# EAGLE design EEGHat (EAGLE 9.6.2)
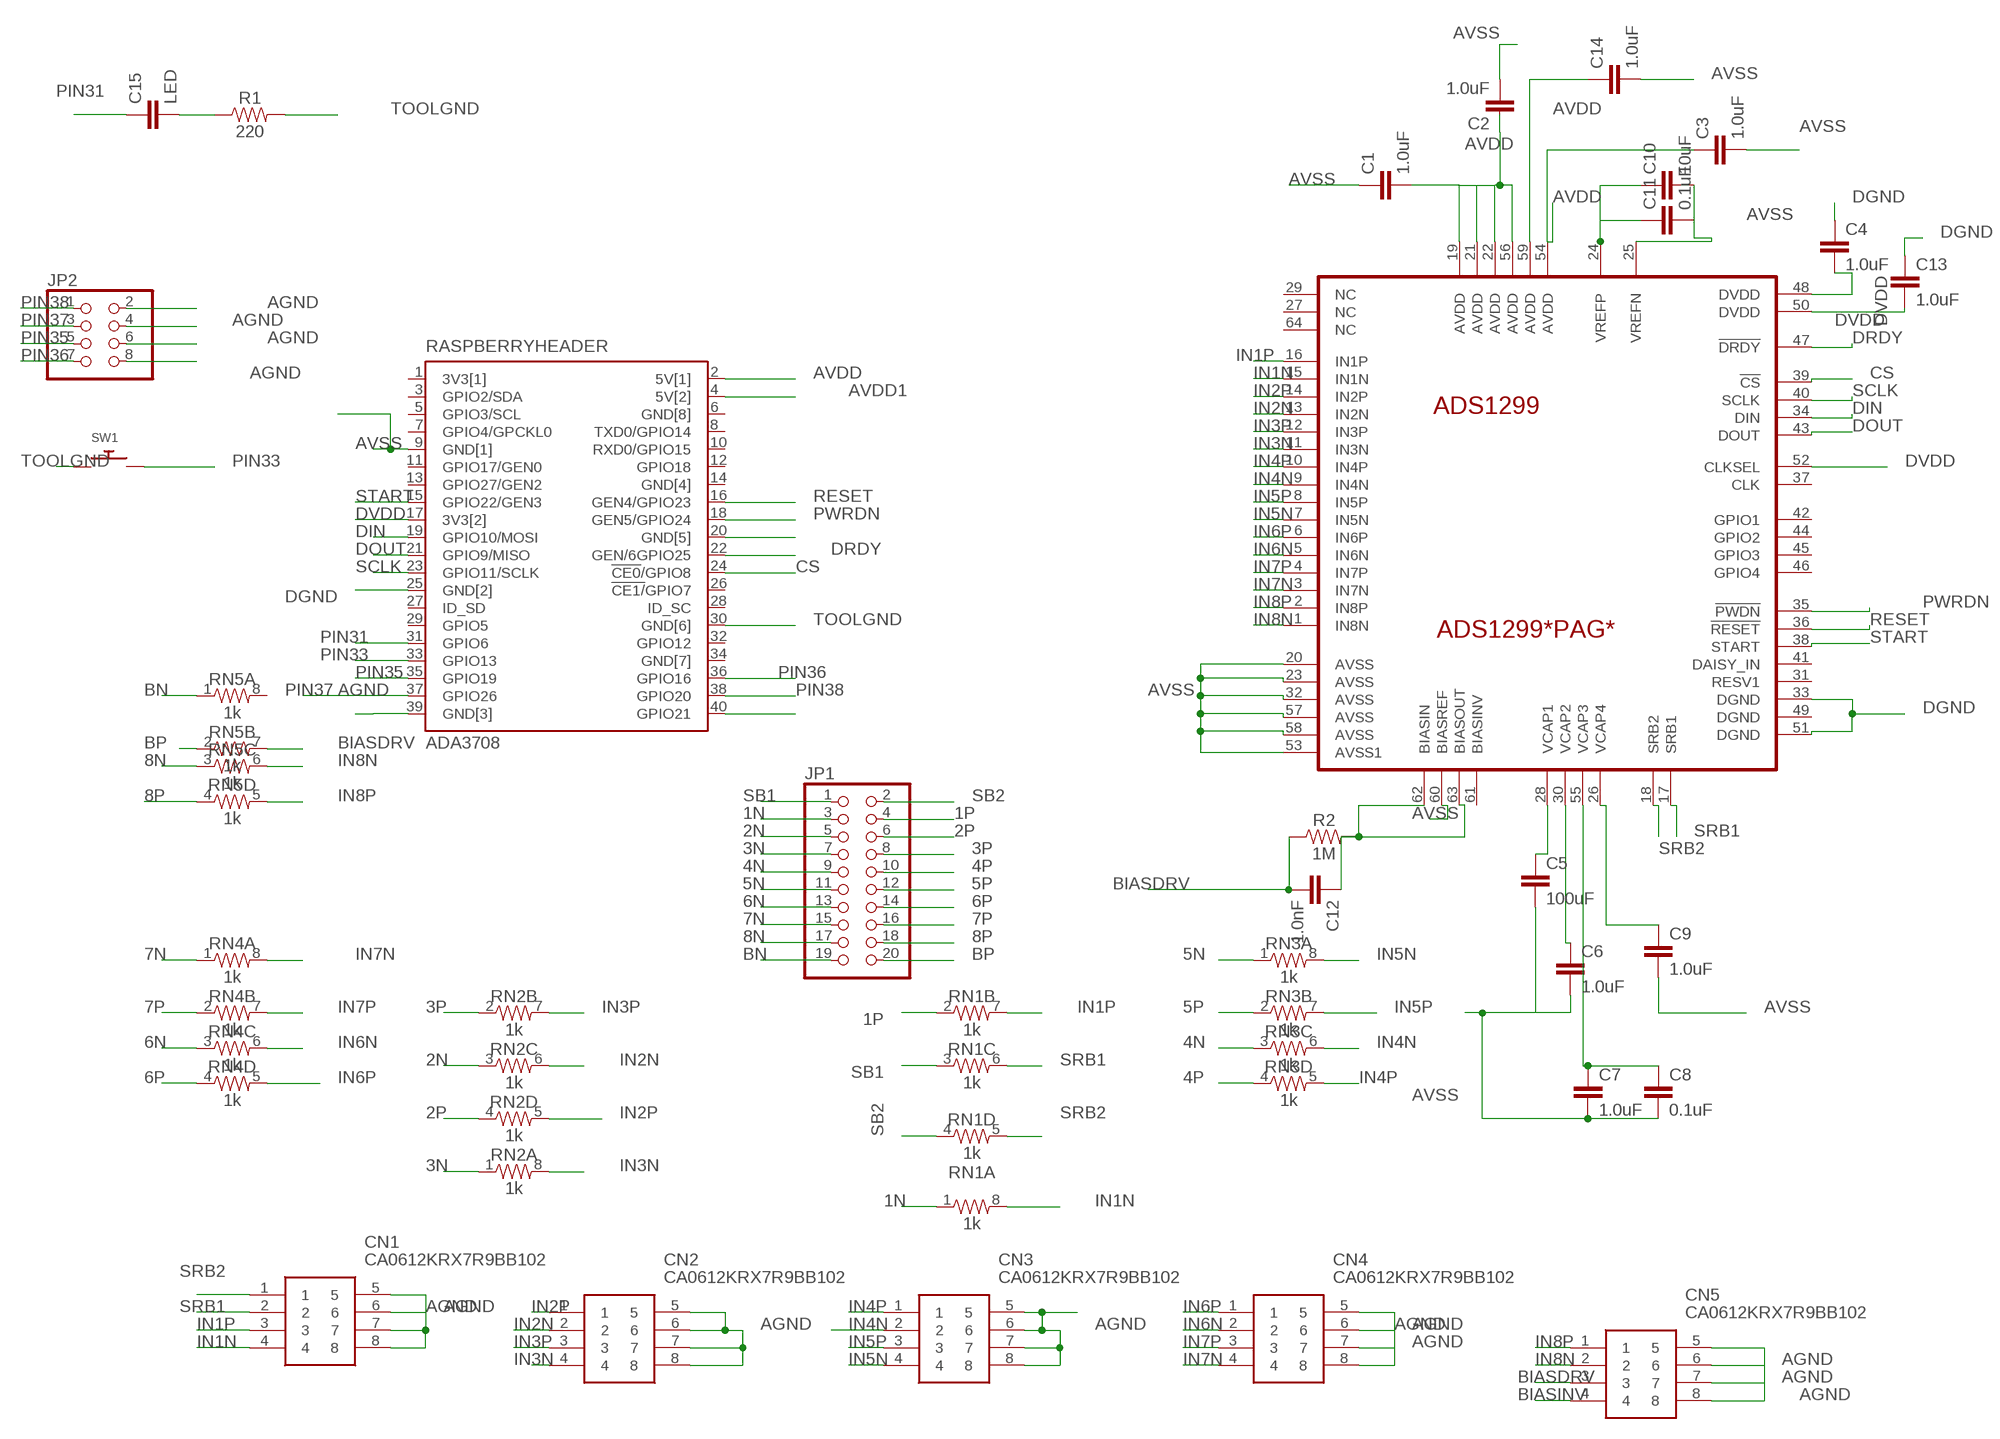
[diagram p0: schematic, sheet 1]

## Parts
ADS1299  ADS1299*PAG*  [TQFP64]
C1  1.0uF  1.0UF-0805-25V-10%  [0805]
C2  1.0uF  1.0UF-0805-25V-10%  [0805]
C3  1.0uF  1.0UF-0805-25V-10%  [0805]
C4  1.0uF  1.0UF-0805-25V-10%  [0805]
C5  100uF  10UF-0805-10V-10%  [0805]
C6  1.0uF  1.0UF-0805-25V-(+80/-20%)  [0805]
C7  1.0uF  1.0UF-0805-25V-(+80/-20%)  [0805]
C8  0.1uF  1.0UF-0805-25V-(+80/-20%)  [0805]
C9  1.0uF  1.0UF-0805-25V-(+80/-20%)  [0805]
C10  10uF  10UF-0805-10V-10%  [0805]
C11  0.1uF  1.0UF-0805-25V-(+80/-20%)  [0805]
C12  1.0nF  1.0UF-0805-25V-(+80/-20%)  [0805]
C13  1.0uF  1.0UF-0805-25V-(+80/-20%)  [0805]
C14  1.0uF  1.0UF-0805-25V-(+80/-20%)  [0805]
C15  LED  2.2UF-0805-25V-(+80/-20%)  [0805]
CN1  CA0612KRX7R9BB102  [CA0612KRX7R9BB102]
CN2  CA0612KRX7R9BB102  [CA0612KRX7R9BB102]
CN3  CA0612KRX7R9BB102  [CA0612KRX7R9BB102]
CN4  CA0612KRX7R9BB102  [CA0612KRX7R9BB102]
CN5  CA0612KRX7R9BB102  [CA0612KRX7R9BB102]
JP1  PINHD-2X10  [2X10]
JP2  PINHD-2X4  [2X04]
R1  220  0.22OHM-0805-1/4W-1%  [0805]
R2  1M  0.3OHM-0805-1/8W-1%  [0805]
RASPBERRYHEADER  ADA3708  [ADA3708_RPI-ZERO]
RN1  1k  1KOHM-ARRAY(4)-0805_ARV-1/10W-5%  [0805-ARV]
RN2  1k  1KOHM-ARRAY(4)-0805_ARV-1/10W-5%  [0805-ARV]
RN3  1k  1KOHM-ARRAY(4)-0805_ARV-1/10W-5%  [0805-ARV]
RN4  1k  1KOHM-ARRAY(4)-0805_ARV-1/10W-5%  [0805-ARV]
RN5  1k  1KOHM-ARRAY(4)-0805_ARV-1/10W-5%  [0805-ARV]
SW1  SWITCH_PUSHBUTTONSOFTTOUCHSMD_SJ  [PUSHBUTTON_SMD_SJ]

## Nets
1N: JP1.3 RN1.1
1P: JP1.4 RN1.2
2N: JP1.5 RN2.3
2P: JP1.6 RN2.4
3N: JP1.7 RN2.1
3P: JP1.8 RN2.2
4N: JP1.9 RN3.3
4P: JP1.10 RN3.4
5N: JP1.11 RN3.1
5P: JP1.12 RN3.2
6N: JP1.13 RN4.3
6P: JP1.14 RN4.4
7N: JP1.15 RN4.1
7P: JP1.16 RN4.2
8N: JP1.17 RN5.3
8P: JP1.18 RN5.4
AGND: CN1.5 CN1.6 CN1.7 CN1.8 CN2.5 CN2.6 CN2.7 CN2.8 CN3.5 CN3.6 CN3.7 CN3.8 CN4.5 CN4.6 CN4.7 CN4.8 CN5.5 CN5.6 CN5.7 CN5.8 JP2.2 JP2.4 JP2.6 JP2.8 RASPBERRYHEADER.39(GND[3])
AVDD: ADS1299.19(AVDD) ADS1299.21(AVDD) ADS1299.22(AVDD) ADS1299.54(AVDD) ADS1299.56(AVDD) ADS1299.59(AVDD) C1.2 C2.1 C3.1 C14.1 RASPBERRYHEADER.2(5V[1])
AVDD1: RASPBERRYHEADER.4(5V[2])
AVSS: ADS1299.20(AVSS) ADS1299.23(AVSS) ADS1299.25(VREFN) ADS1299.32(AVSS) ADS1299.53(AVSS1) ADS1299.57(AVSS) ADS1299.58(AVSS) ADS1299.60(BIASREF) C1.1 C2.2 C3.2 C5.2 C6.2 C7.2 C8.2 C9.2 C10.2 C11.2 C14.2 RASPBERRYHEADER.9(GND[1])
BIASDRV: C12.2 CN5.3 R2.1 RN5.7
BIASINV: CN5.4
BN: JP1.19 RN5.1
BP: JP1.20 RN5.2
CS: ADS1299.39(!CS) RASPBERRYHEADER.24(!CE0!/GPIO8)
DGND: ADS1299.33(DGND) ADS1299.51(DGND) C4.1 C13.1 RASPBERRYHEADER.25(GND[2])
DIN: ADS1299.34(DIN) RASPBERRYHEADER.19(GPIO10/MOSI)
DOUT: ADS1299.43(DOUT) RASPBERRYHEADER.21(GPIO9/MISO)
DRDY: ADS1299.47(!DRDY) RASPBERRYHEADER.22(GEN/6GPIO25)
DVDD: ADS1299.48(DVDD) ADS1299.50(DVDD) ADS1299.52(CLKSEL) C4.2 C13.2 RASPBERRYHEADER.17(3V3[2])
IN1N: ADS1299.15(IN1N) CN1.4 RN1.8
IN1P: ADS1299.16(IN1P) CN1.3 RN1.7
IN2N: ADS1299.13(IN2N) CN2.2 RN2.6
IN2P: ADS1299.14(IN2P) CN2.1 RN2.5
IN3N: ADS1299.11(IN3N) CN2.4 RN2.8
IN3P: ADS1299.12(IN3P) CN2.3 RN2.7
IN4N: ADS1299.9(IN4N) CN3.2 RN3.6
IN4P: ADS1299.10(IN4P) CN3.1 RN3.5
IN5N: ADS1299.7(IN5N) CN3.4 RN3.8
IN5P: ADS1299.8(IN5P) CN3.3 RN3.7
IN6N: ADS1299.5(IN6N) CN4.2 RN4.6
IN6P: ADS1299.6(IN6P) CN4.1 RN4.5
IN7N: ADS1299.3(IN7N) CN4.4 RN4.8
IN7P: ADS1299.4(IN7P) CN4.3 RN4.7
IN8N: ADS1299.1(IN8N) CN5.2 RN5.6
IN8P: ADS1299.2(IN8P) CN5.1 RN5.5
N$1: ADS1299.62(BIASIN) ADS1299.63(BIASOUT) C12.1 R2.2
N$2: ADS1299.28(VCAP1) C5.1
N$3: ADS1299.24(VREFP) C10.1 C11.1
N$4: C15.2 R1.1
N$6: ADS1299.30(VCAP2) C6.1
N$7: ADS1299.55(VCAP3) C7.1 C8.1
N$8: ADS1299.26(VCAP4) C9.1
N$10: RASPBERRYHEADER.20(GND[5])
N$17: RASPBERRYHEADER.40(GPIO21)
PIN31: C15.1 RASPBERRYHEADER.31(GPIO6)
PIN33: RASPBERRYHEADER.33(GPIO13) SW1.P$2
PIN35: JP2.5 RASPBERRYHEADER.35(GPIO19)
PIN36: JP2.7 RASPBERRYHEADER.36(GPIO16)
PIN37: JP2.3 RASPBERRYHEADER.37(GPIO26)
PIN38: JP2.1 RASPBERRYHEADER.38(GPIO20)
PWRDN: ADS1299.35(!PWDN) RASPBERRYHEADER.18(GEN5/GPIO24)
RESET: ADS1299.36(!RESET) RASPBERRYHEADER.16(GEN4/GPIO23)
SB1: JP1.1 RN1.3
SB2: JP1.2 RN1.4
SCLK: ADS1299.40(SCLK) RASPBERRYHEADER.23(GPIO11/SCLK)
SRB1: ADS1299.17(SRB1) CN1.2 RN1.6
SRB2: ADS1299.18(SRB2) CN1.1 RN1.5
START: ADS1299.38(START) RASPBERRYHEADER.15(GPIO22/GEN3)
TOOLGND: R1.2 RASPBERRYHEADER.30(GND[6]) SW1.P$1
Unconnected: ADS1299.27(NC) ADS1299.29(NC) ADS1299.31(RESV1) ADS1299.37(CLK) ADS1299.41(DAISY_IN) ADS1299.42(GPIO1) ADS1299.44(GPIO2) ADS1299.45(GPIO3) ADS1299.46(GPIO4) ADS1299.61(BIASINV) ADS1299.64(NC) RASPBERRYHEADER.3(GPIO2/SDA) RASPBERRYHEADER.5(GPIO3/SCL) RASPBERRYHEADER.7(GPIO4/GPCKL0) RASPBERRYHEADER.8(TXD0/GPIO14) RASPBERRYHEADER.10(RXD0/GPIO15) RASPBERRYHEADER.11(GPIO17/GEN0) RASPBERRYHEADER.12(GPIO18) RASPBERRYHEADER.13(GPIO27/GEN2) RASPBERRYHEADER.26(!CE1/!GPIO7) RASPBERRYHEADER.27(ID_SD) RASPBERRYHEADER.28(ID_SC) RASPBERRYHEADER.29(GPIO5) RASPBERRYHEADER.32(GPIO12) RN5.8

## Power pins joined to a net without a drawn wire
3V3[1]: RASPBERRYHEADER.1(3V3[1])
DGND: ADS1299.49(DGND)
GND[4]: RASPBERRYHEADER.14(GND[4])
GND[7]: RASPBERRYHEADER.34(GND[7])
GND[8]: RASPBERRYHEADER.6(GND[8])

## Library data of the parts
ADS1299 = ADS1299:ADS1299: 8-Channel, 24-Bit Analog-To-Digital Converter With Integrated EEG Front End. ADS1299 modifications by Adam Feuer (adam@adamfeuer.com) Based on ADS1298: Drawn 23.07.2011 by Tomasz Boleslaw CEDRO (http://www.tomek.cedro.info). Check prices <https://pricing.snapeda.com/parts/ADS1299/Texas%20Instruments/view-part?ref=eda>; AVAILABILITY: In Stock; DESCRIPTION: AFE General Purpose 8 ADC 24bit 5V 64-Pin TQFP Tube; MF: Texas Instruments; MP: ADS1299; PACKAGE: TQFP-64 Texas Instruments; PRICE: None; PURCHASE-URL: https://pricing.snapeda.com/search/part/ADS1299/?ref=eda
C1-C4 = SparkFun-Capacitors:1.0UF: 1µF ceramic capacitors A capacitor is a passive two-terminal electrical component used to store electrical energy temporarily in an electric field.; PROD_ID: CAP-08064
C5 = SparkFun-Capacitors:10UF: 10.0µF ceramic capacitors A capacitor is a passive two-terminal electrical component used to store electrical energy temporarily in an electric field.; PROD_ID: CAP-11330; VALUE: 10uF
C6 C7 C9 C13 C14 = SparkFun-Capacitors:1.0UF: 1µF ceramic capacitors A capacitor is a passive two-terminal electrical component used to store electrical energy temporarily in an electric field.; PROD_ID: CAP-11625
C8 C11 C12 = SparkFun-Capacitors:1.0UF: 1µF ceramic capacitors A capacitor is a passive two-terminal electrical component used to store electrical energy temporarily in an electric field.; PROD_ID: CAP-11625; VALUE: 1.0uF
C10 = SparkFun-Capacitors:10UF: 10.0µF ceramic capacitors A capacitor is a passive two-terminal electrical component used to store electrical energy temporarily in an electric field.; PROD_ID: CAP-11330
C15 = SparkFun-Capacitors:2.2UF: 2.2µF ceramic capacitors A capacitor is a passive two-terminal electrical component used to store electrical energy temporarily in an electric field.; PROD_ID: CAP-11624; VALUE: 2.2uF
CN1-CN5 = CA0612KRX7R9BB102:CA0612KRX7R9BB102: Capacitor,ceramic,multilayer,SMT,50V,1pF Source: Datasheet <http://uk.rs-online.com/web/p/products/6169789> Check prices <https://pricing.snapeda.com/parts/CA0612KRX7R9BB102/Yageo/view-part?ref=eda>; AVAILABILITY: In Stock; DESCRIPTION: 1000pF Isolated Capacitor 4 Array 50 V X7R 0612 (1632 Metric); MF: Yageo; MP: CA0612KRX7R9BB102; PACKAGE: 0612 Yageo; PRICE: None; PURCHASE-URL: https://pricing.snapeda.com/search/part/CA0612KRX7R9BB102/?ref=eda
JP1 = pinhead:PINHD-2X10: PIN HEADER
JP2 = pinhead:PINHD-2X4: PIN HEADER
R1 = SparkFun-Resistors:0.22OHM: 0.22Ω resistor A resistor is a passive two-terminal electrical component that implements electrical resistance as a circuit element. Resistors act to reduce current flow, and, at the same time, act to lower voltage levels within circuits. - Wikipedia; PROD_ID: RES-09883; VALUE: 0.22
R2 = SparkFun-Resistors:0.3OHM: 0.3Ω resistor A resistor is a passive two-terminal electrical component that implements electrical resistance as a circuit element. Resistors act to reduce current flow, and, at the same time, act to lower voltage levels within circuits. - Wikipedia; PROD_ID: RES-11622; VALUE: 0.3
RASPBERRYHEADER = ADA3708:ADA3708: Raspberry Pi Zero WH (Zero W with Headers) Check prices <https://pricing.snapeda.com/parts/ADA3708/Adafruit%20Industries/view-part?ref=eda>; AVAILABILITY: Not in stock; DESCRIPTION: Raspberry Pi Zero WH (Zero W with Headers); MF: Adafruit Industries; MP: ADA3708; PACKAGE: None; PRICE: None
RN1-RN5 = SparkFun-Resistors:1KOHM-ARRAY(4): 4 x 1kΩ resistor array A resistor is a passive two-terminal electrical component that implements electrical resistance as a circuit element. Resistors act to reduce current flow, and, at the same time, act to lower voltage levels within circuits. - Wikipedia An array is a collection of discrete resistors in a single package.; PROD_ID: RES-13020
SW1 = adafruit:SWITCH_PUSHBUTTON: Buttons SOFTTOUCHSMD_SJ - Soft touch temporary push button (Super Junk Akihabara) Compatible with SKPMANE010 [Mouser: 688-SKPMAN] C&K_KSS = Digikey: KSS221GLFS

## Board
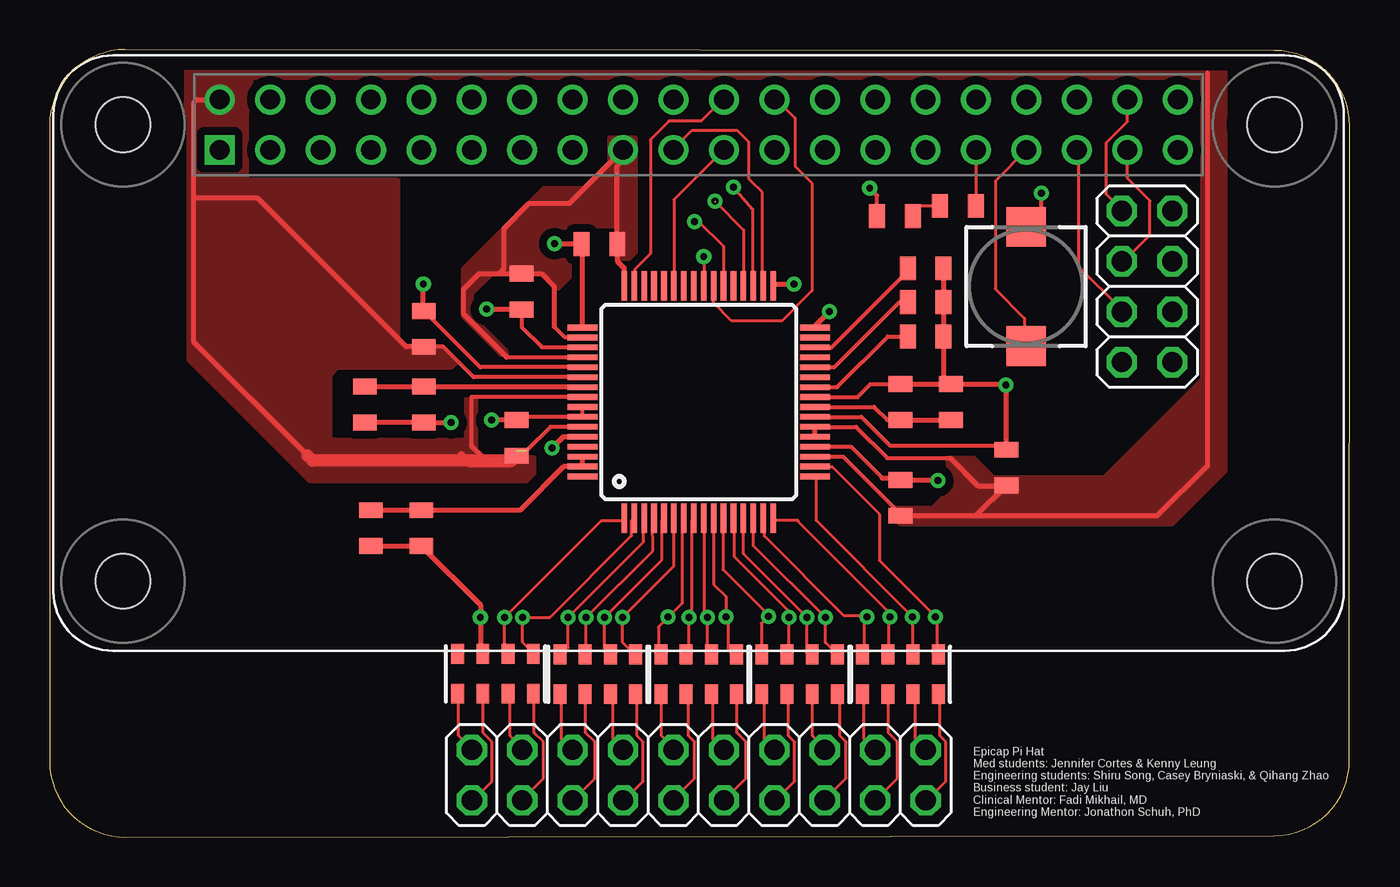
[diagram p1: board, top side]
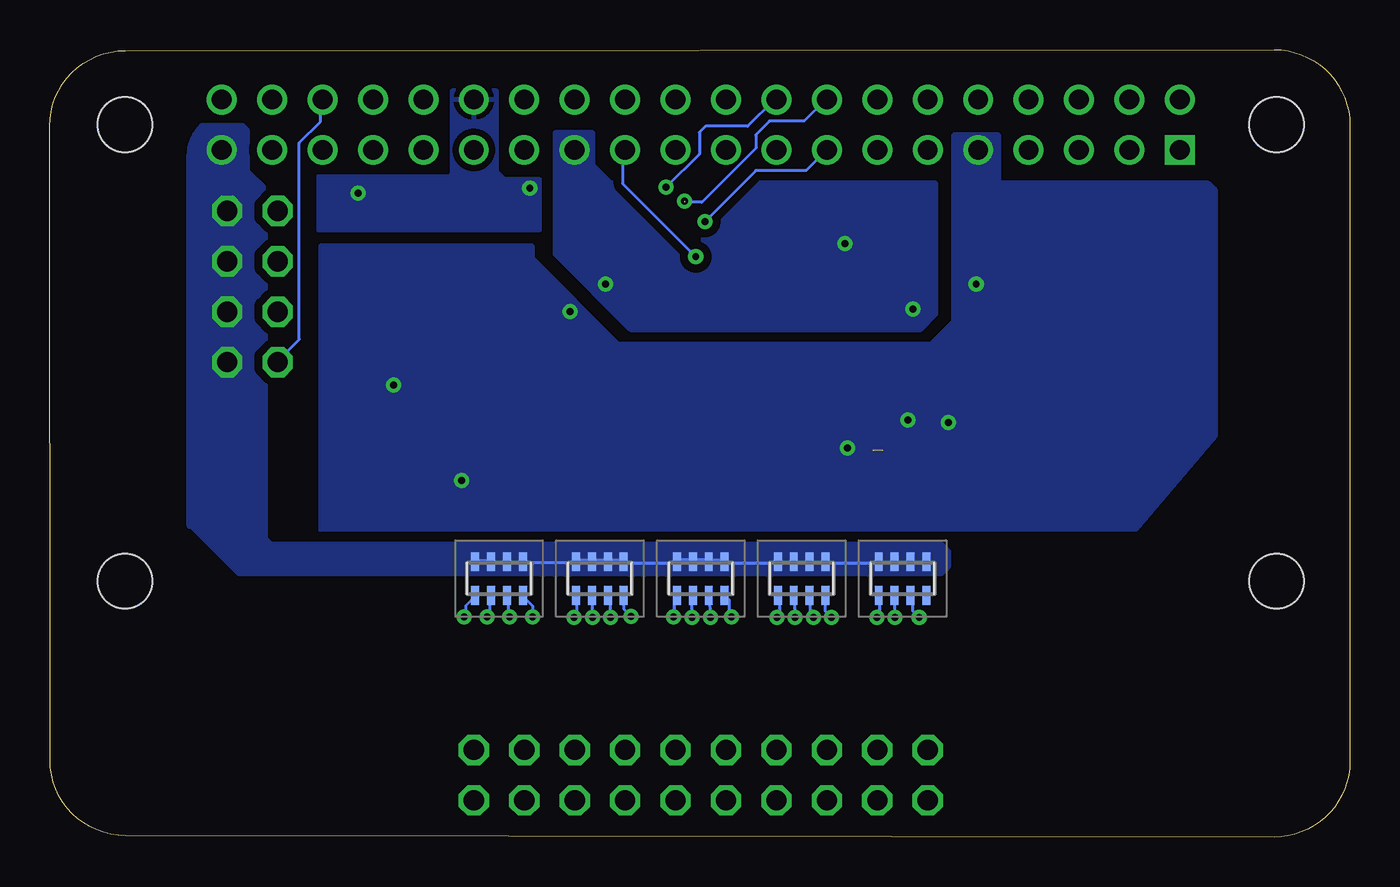
[diagram p2: board, bottom side, seen from below]

Size 65.48 x 39.67 mm. Coordinates in mm from the lower left corner, seen from the top.
Outline: 0,35.86 0,3.81 arc90 3.81,0 61.66,0.07 arc90 65.46,3.88 65.48,35.81 arc90 61.68,39.62 3.81,39.67 arc90 0,35.86
Copper layers (1*16): Top 0.035mm / dielectric 1.5mm / Bottom 0.035mm
Design rules "default *": minimum track width 6mil, minimum drill 0.35mm, track to track 6mil, track to pad 6mil, pad to pad 6mil, via to via 6mil, smd to smd 6mil, copper to edge 40mil, drill to drill 6mil, minimum pad ring 10mil, minimum via ring 8mil, stop-mask expansion 4mil, vias tented up to drill 0mil, thermal gap 10mil

### Footprints (pad centres in the part's own frame; a part is rotated, then mirrored left to right if it is on the bottom)
TQFP64 = smd 1.5 x 0.285: 1 -5.85,3.75; 2 -5.85,3.25; 3 -5.85,2.75; 4 -5.85,2.25; 5 -5.85,1.75; 6 -5.85,1.25; 7 -5.85,0.75; 8 -5.85,0.25; 9 -5.85,-0.25; 10 -5.85,-0.75; 11 -5.85,-1.25; 12 -5.85,-1.75; 13 -5.85,-2.25; 14 -5.85,-2.75; 15 -5.85,-3.25; 16 -5.85,-3.75; 33 5.85,-3.75; 34 5.85,-3.25; 35 5.85,-2.75; 36 5.85,-2.25; 37 5.85,-1.75; 38 5.85,-1.25; 39 5.85,-0.75; 40 5.85,-0.25; 41 5.85,0.25; 42 5.85,0.75; 43 5.85,1.25; 44 5.85,1.75; 45 5.85,2.25; 46 5.85,2.75; 47 5.85,3.25; 48 5.85,3.75 | smd 0.285 x 1.5: 17 -3.75,-5.85; 18 -3.25,-5.85; 19 -2.75,-5.85; 20 -2.25,-5.85; 21 -1.75,-5.85; 22 -1.25,-5.85; 23 -0.75,-5.85; 24 -0.25,-5.85; 25 0.25,-5.85; 26 0.75,-5.85; 27 1.25,-5.85; 28 1.75,-5.85; 29 2.25,-5.85; 30 2.75,-5.85; 31 3.25,-5.85; 32 3.75,-5.85; 49 3.75,5.85; 50 3.25,5.85; 51 2.75,5.85; 52 2.25,5.85; 53 1.75,5.85; 54 1.25,5.85; 55 0.75,5.85; 56 0.25,5.85; 57 -0.25,5.85; 58 -0.75,5.85; 59 -1.25,5.85; 60 -1.75,5.85; 61 -2.25,5.85; 62 -2.75,5.85; 63 -3.25,5.85; 64 -3.75,5.85
0805 = smd 0.8 x 1.2: 1 -0.9,0; 2 0.9,0
CA0612KRX7R9BB102 = smd 0.95 x 0.4: 1 -0.85,1.2; 2 -0.85,0.4; 3 -0.85,-0.4; 4 -0.85,-1.2; 5 0.85,-1.2; 6 0.85,-0.4; 7 0.85,0.4; 8 0.85,1.2
2X10 = drill 1.016 octagon: 1 -11.43,-1.27; 2 -11.43,1.27; 3 -8.89,-1.27; 4 -8.89,1.27; 5 -6.35,-1.27; 6 -6.35,1.27; 7 -3.81,-1.27; 8 -3.81,1.27; 9 -1.27,-1.27; 10 -1.27,1.27; 11 1.27,-1.27; 12 1.27,1.27; 13 3.81,-1.27; 14 3.81,1.27; 15 6.35,-1.27; 16 6.35,1.27; 17 8.89,-1.27; 18 8.89,1.27; 19 11.43,-1.27; 20 11.43,1.27
2X04 = drill 1.016 octagon: 1 -3.81,-1.27; 2 -3.81,1.27; 3 -1.27,-1.27; 4 -1.27,1.27; 5 1.27,-1.27; 6 1.27,1.27; 7 3.81,-1.27; 8 3.81,1.27
ADA3708_RPI-ZERO = drill 1 square: 1 -24.13,-1.27 | drill 1: 2 -24.13,1.27; 3 -21.59,-1.27; 4 -21.59,1.27; 5 -19.05,-1.27; 6 -19.05,1.27; 7 -16.51,-1.27; 8 -16.51,1.27; 9 -13.97,-1.27; 10 -13.97,1.27; 11 -11.43,-1.27; 12 -11.43,1.27; 13 -8.89,-1.27; 14 -8.89,1.27; 15 -6.35,-1.27; 16 -6.35,1.27; 17 -3.81,-1.27; 18 -3.81,1.27; 19 -1.27,-1.27; 20 -1.27,1.27; 21 1.27,-1.27; 22 1.27,1.27; 23 3.81,-1.27; 24 3.81,1.27; 25 6.35,-1.27; 26 6.35,1.27; 27 8.89,-1.27; 28 8.89,1.27; 29 11.43,-1.27; 30 11.43,1.27; 31 13.97,-1.27; 32 13.97,1.27; 33 16.51,-1.27; 34 16.51,1.27; 35 19.05,-1.27; 36 19.05,1.27; 37 21.59,-1.27; 38 21.59,1.27; 39 24.13,-1.27; 40 24.13,1.27 | hole 2.75: -29,-23; -29,0; 29,-23; 29,0
0805-ARV = smd 0.65 x 1: 1 -1.905,-1; 2 -0.635,-1; 3 0.635,-1; 4 1.905,-1; 5 1.905,1; 6 0.635,1; 7 -0.635,1; 8 -1.905,1
PUSHBUTTON_SMD_SJ = smd 2 x 2: P$1 3,0; P$2 -3,0

### Placement (x,y rotation side)
ADS1299  32.69,21.92 90 top
C1  48.18,18.61 270 top
C2  42.85,17.09 90 top
C3  18.85,25.6 90 top
C4  27.69,29.87 0 top
C5  44.12,26.94 0 top
C6  44.12,28.65 0 top
C7  15.88,21.79 270 top
C8  18.85,21.79 270 top
C9  44.12,25.22 0 top
C10  42.85,21.92 90 top
C11  45.39,21.92 90 top
C12  18.72,15.57 270 top
C13  23.77,27.48 90 top
C14  23.52,20.11 90 top
C15  45.75,31.8 180 top
CN1  42.85,13.03 90 bottom
CN2  37.77,13.03 90 bottom
CN3  32.69,13.03 90 bottom
CN4  27.61,13.03 90 bottom
CN5  22.53,13.03 90 bottom
JP1  32.69,3.12 180 top
JP2  55.27,27.73 270 top
R1  42.57,31.29 180 top
R2  16.18,15.57 90 top
RASPBERRYHEADER  32.69,35.89 0 top
RN1  42.85,8.2 0 top
RN2  37.77,8.2 0 top
RN3  32.69,8.2 0 top
RN4  27.61,8.2 0 top
RN5  22.45,8.23 0 top
SW1  49.17,27.73 90 top

### Tracks (layer width: path | path; a pad name or v marks a point on that pad's centre or on a via)
1N
  Top 0.152: JP1.3 41.02,4.95 41.02,7.08 RN1.1
1P
  Top 0.152: JP1.4 42.7,2.97 42.7,4.8 42.24,5.25 42.24,7.08 RN1.2
2N
  Top 0.152: RN2.3 38.43,7.08 38.43,5.1 39.04,4.49 JP1.5
2P
  Top 0.152: RN2.4 39.8,7.08 39.8,5.1 40.11,4.8 40.11,2.97 39.04,1.9 JP1.6
3N
  Top 0.152: RN2.1 35.99,7.08 35.99,4.95 36.45,4.49 JP1.7
3P
  Top 0.152: RN2.2 37.21,7.08 37.21,5.1 37.52,4.8 37.52,2.82 36.6,1.9 JP1.8
4N
  Top 0.152: JP1.9 33.4,4.95 33.4,7.08 RN3.3
4P
  Top 0.152: JP1.10 35.08,2.97 35.08,4.8 34.62,5.25 34.62,7.08 RN3.4
5N
  Top 0.152: RN3.1 30.81,7.08 30.81,5.1 31.42,4.49 JP1.11
5P
  Top 0.152: RN3.2 32.18,7.08 32.18,5.1 32.49,4.8 32.49,2.97 31.42,1.9 JP1.12
6N
  Top 0.152: RN4.3 28.37,7.08 28.37,4.95 28.83,4.49 JP1.13
6P
  Top 0.152: RN4.4 29.59,7.08 29.59,5.1 29.9,4.8 29.9,2.82 28.98,1.9 JP1.14
7N
  Top 0.152: JP1.15 25.78,4.95 25.78,7.08 RN4.1
7P
  Top 0.152: JP1.16 27.46,2.97 27.46,4.8 27,5.25 27,7.08 RN4.2
8N
  Top 0.152: RN5.3 23.19,7.08 23.19,5.1 23.8,4.49 JP1.17
8P
  Top 0.152: RN5.4 24.41,7.08 24.41,5.25 24.87,4.8 24.87,2.97 23.8,1.9 JP1.18
AGND
  Bottom 0.152: 21.39,13.51 21.39,13.81 CN5.5 | 23.67,13.51 23.67,13.81 CN5.8 23.83,13.81 26.26,13.81 CN4.5 26.42,13.81 | 28.7,13.51 28.7,13.81 CN4.8 28.85,13.81 31.45,13.81 CN3.5 31.6,13.97 32.21,13.97 CN3.6 32.36,13.97 32.97,13.97 CN3.7 33.12,13.97 33.88,13.97 CN3.8 34.04,13.81 36.47,13.81 CN2.5 36.63,13.97 37.24,13.97 CN2.6 37.39,13.97 38.15,13.97 CN2.7 38.3,13.97 38.91,13.97 CN2.8 39.07,13.81 41.5,13.81 CN1.5 41.66,13.81
  Bottom 0.254: CN1.8 CN1.7
  pour Bottom (isolate 0.406, no thermals): 55.52,35.61 55.52,33.57 54.64,32.69 54.64,15.03 54.38,14.78 20.6,14.78 20.22,14.4 20.22,13.64 20.6,13.25 55.91,13.25 58.32,15.67 58.45,15.67 58.45,34.33 arc45 57.81,35.86 55.78,35.86
AVDD  (1 unrouted)
  Top 0.203: ADS1299.54 21.36,23.17 19.82,24.7 C3.1 | 23.52,19.48 C14.1 23.39,19.09 21.88,19.09 | ADS1299.59 25.22,20.67 24.03,19.48 | ADS1299.56 21.23,22.17 21.23,19.73 | ADS1299.22 40.62,20.67 42.19,19.1 45.36,19.1 | ADS1299.19 39.96,19.17 42.85,16.28 C2.1
  Top 0.254: 21.23,19.73 21.88,19.09 | 45.36,19.1 46.76,17.7 48.17,17.7 C1.2 46.66,16.19 | ADS1299.21 ADS1299.22 | 12.99,19.21 7.26,24.94 7.26,32.18 | 7.26,32.18 7.26,37 7.42,37.16 RASPBERRYHEADER.2 | C3.1 17.96,24.7 10.48,32.18 7.26,32.18 | C2.1 46.66,16.19 | 46.66,16.19 55.79,16.19 58.32,18.72 58.32,38.48
  Top 0.406: C14.1 23.14,18.83 21.12,18.83 20.73,19.22
  Top 0.61: C14.1 23.27,18.96 13.24,18.96 12.99,19.21 12.98,19.22
  pour Top (isolate 0.406, no thermals): 7.01,38.53 7.01,24.05 13.11,17.95 24.03,17.95 24.41,18.33 24.41,19.1 21.49,19.1 21.49,22.14 20.98,22.14 20.98,19.99 14.25,19.99 14.12,20.11 14.12,23.29 14.5,23.67 20.22,23.67 20.54,23.99 19.84,24.68 17.55,24.68 17.55,33.07 10.06,33.07 9.93,33.19 9.93,38.53
  pour Top (isolate 0.406, no thermals): 9.8,36.37 10.06,36.62 10.06,37.64 10.15,37.73 10.15,38.27 58.06,38.27 58.06,23.03 53.11,18.08 47.52,18.08 46.38,19.22 45.24,19.22 45.24,18.46 45.62,18.08 45.62,17.57 45.11,17.06 44.98,17.06 44.48,16.56 42.44,16.56 42.44,16.18 42.82,15.79 56.54,15.79 59.21,18.46 59.21,38.78 58.57,39.42 6.88,39.42 6.88,36.37
AVSS  (via drill 0.35)
  Top 0.152: 47.6,19.73 47.6,19.76 48.21,19.76 C1.1
  Top 0.203: ADS1299.53 21.68,23.67 C3.2 | ADS1299.57 ADS1299.58 23.67,21.17 C14.2 | ADS1299.25 40.69,22.17 41.34,22.82 C10.2 | ADS1299.23 40.88,21.17 42.32,19.73 47.6,19.73 47.65,19.73 | ADS1299.20 40.35,19.67 41.94,18.08
  Top 0.254: C7.2 C8.2 20.2,20.89 v20.22,20.87 | ADS1299.60 25.86,20.17 v25.3,19.6 | C3.2 18.82,26.52 v18.82,27.86 | v39.27,26.46 38.54,25.73 ADS1299.32 | C6.2 C5.2 C9.2 45.02,23.19 C11.2 | C11.2 48.12,22.82 v48.16,22.78 48.18,22.75 C1.1 | 41.94,18.08 42.76,18.08 C2.2 44.69,17.99 v44.73,17.95 | C14.2 22.26,21.01 v22.25,21 | C10.2 C11.2
  pour Bottom (isolate 0.406, no thermals): 19.96,35.35 19.96,25.95 21.11,24.81 36.86,24.81 41.17,29.13 41.17,29.76 51.84,29.76 51.84,15.51 10.76,15.51 6.76,20.24 6.76,32.56 7.14,32.94 17.68,32.94 17.68,35.35
BIASDRV  (via drill 0.35)
  Top 0.254: R2.1 C12.2 21.69,11.69 v21.69,11.07 21.69,9.35 RN5.7
  Bottom 0.152: v21.69,11.07 22,11.37 22,12.16 22.12,12.16 | 22.12,12.16 22.13,12.16 | CN5.3 22.12,12.11 22.12,12.16
BN
  Top 0.152: RN5.1 20.6,7.08 20.6,5.1 21.21,4.49 JP1.19
BP
  Top 0.152: RN5.2 21.82,5.25 22.28,4.8 22.28,2.82 21.36,1.9 JP1.20
CS
  Top 0.152: ADS1299.39 33.43,27.68 33.43,26.92 34.34,26.01 36.88,26.01 38.4,27.53 38.4,32.94 37.54,33.8 37.54,36.22 36.63,37.13 RASPBERRYHEADER.24
DGND  (via drill 0.35)
  Top 0.152: ADS1299.51 26.72,24.63 26.26,24.63 26.26,24.68
  Top 0.203: C13.1 23.77,25.7 24.79,24.68 26.26,24.68 26.31,24.68
  Top 0.254: 26.82,24.68 ADS1299.51 | ADS1299.49 26.84,29.81 C4.1 26.76,29.89 v25.43,29.89 | ADS1299.33 36.53,27.86 v37.49,27.86 | v22,26.59 23.76,26.59 C13.1
  pour Bottom (isolate 0.406, no thermals): 37.24,32.94 38.13,33.83 38.13,35.48 40.03,35.48 40.03,29.38 36.22,25.57 21.62,25.57 20.85,26.34 20.85,32.94
DIN
  Top 0.152: 35.38,32.99 35.2,33.17 35.2,35.02 34.62,35.61 32.36,35.61 31.45,34.69 RASPBERRYHEADER.19 | 35.38,32.99 35.86,32.51 35.86,27.83 ADS1299.34 | 35.38,32.99
DOUT
  Top 0.152: RASPBERRYHEADER.21 31.45,32.1 31.45,27.83 ADS1299.43
DRDY
  Top 0.152: ADS1299.47 29.46,27.83 29.46,28.6 30.25,29.38 30.25,35.12 31.19,36.06 32.82,36.06 33.88,37.13 RASPBERRYHEADER.22
DVDD
  Top 0.203: ADS1299.52 23.02,24.17 23.01,24.18 | ADS1299.50 25.96,25.17 25.43,25.7
  Top 0.254: 25.43,25.7 25.43,27.74 24.79,28.38 C13.2 22.63,28.38 | ADS1299.48 28.94,28.66 28.59,29.02 C4.2 28.59,33.81 28.88,34.11 RASPBERRYHEADER.17 26.19,31.92 24.16,31.92 22.89,30.65 22.89,28.63 22.63,28.38 | 23.01,24.18 20.85,26.34 20.85,27.61 21.63,28.38 22.63,28.38
  pour Top (isolate 0.406, no thermals): 28.22,33.96 28.22,35.23 29.49,35.23 29.49,29.38 29.24,29.13 28.6,29.13 28.6,30.78 26.19,30.78 26.19,28.24 25.55,27.61 24.79,28.37 22.25,28.37 21.23,27.35 21.23,26.21 23.01,24.43 23.01,24.3 22.76,24.3 20.85,26.21 20.85,28.62 24.92,32.69 26.95,32.69
IN1N  (via drill 0.35)
  Top 0.152: 36.02,15.95 35.95,16.04 | 35.95,16.04 35.93,16.06 | 35.95,16.04 35.99,16.07 ADS1299.15 35.99,15.92 35.99,15.16 40.01,11.15 41.02,11.15 41.02,10.89 | 41.02,10.89 41.02,9.22 RN1.8 | 41.02,10.89 41.17,11.04 v41.17,11.1 41.02,10.89
  Bottom 0.152: v41.17,11.1 41.17,11.65 41.63,12.11 CN1.4
IN1P  (via drill 0.35)
  Top 0.152: 37.69,15.95 37.67,15.95 | 37.67,15.95 36.47,15.95 36.46,16.07 36.45,16.07 ADS1299.16 | RN1.7 42.24,9.22 42.24,11.04 v42.32,11.1 42.39,11.2 37.67,15.92 37.67,15.95
  Bottom 0.152: CN1.3 42.42,12.14 42.39,12.11 | 42.39,12.11 42.39,11.2 v42.32,11.1 | 42.39,12.11 CN1.3
IN2N  (via drill 0.35)
  Top 0.152: RN2.6 38.15,9.23 v38.15,11.07 34.95,14.27 34.95,15.92 | 34.95,15.92 34.95,15.95 ADS1299.13 | 34.95,15.92 34.93,15.92 ADS1299.13
  Bottom 0.152: v38.15,11.07 38.15,12.11 | 38.15,12.11 38.15,12.14 CN2.2 | CN2.2 38.13,12.11 38.15,12.11
IN2P  (via drill 0.35)
  Top 0.152: RN2.5 39.65,9.22 39.07,9.8 v39.07,11.07 35.43,14.7 ADS1299.14
  Bottom 0.152: 38.92,12.11 38.91,11.22 v39.07,11.07 | 38.92,12.11 38.92,12.13 CN2.1 | CN2.1 38.89,12.11 38.92,12.11
IN3N  (via drill 0.35)
  Top 0.152: ADS1299.11 33.91,16.04 33.91,13.48 36.23,11.16 v36.2,11.12 35.84,10.77 35.84,9.23 RN2.8
  Bottom 0.152: CN2.4 36.57,11.5 36.28,11.21 | 36.28,11.21 v36.2,11.12 | v36.2,11.12 | 36.28,11.21 36.3,11.2 v36.2,11.12
IN3P  (via drill 0.35)
  Top 0.152: RN2.7 37.21,9.22 37.24,9.24 v37.24,11.07 37.24,11.37 34.49,14.12 34.49,15.92 | 34.49,15.92 34.49,15.95 34.42,16.05 | 34.49,15.92 34.47,15.92 ADS1299.12
  Bottom 0.152: v37.24,11.07 37.24,12.14 37.36,12.15 | 37.36,12.15 37.37,12.16 | CN2.3 37.36,12.11 37.36,12.15
IN4N  (via drill 0.35)
  Top 0.152: RN3.6 33.12,9.24 v33.12,11.07 32.97,11.22 32.97,15.92 | 32.97,15.92 32.97,15.95 32.95,16.07 | 32.97,15.92 32.94,15.92 ADS1299.9
  Bottom 0.152: v33.12,11.07 33.12,12.11 | 33.12,12.11 33.12,12.14 CN3.2 | CN3.2 33.1,12.11 33.12,12.11
IN4P  (via drill 0.35)
  Top 0.152: 34.62,9.22 RN3.5 34.47,9.22 34.19,9.5 34.19,11.04 | 34.19,11.04 34.19,11.07 | 33.43,15.95 ADS1299.10 33.4,16.07 ADS1299.10 33.44,12.73 34.06,12.11 v34.06,11.1 34.16,11.04 34.19,11.04
  Bottom 0.152: 34.05,11.22 34.04,12.14 33.89,12.16 33.86,12.11 CN3.1 | 34.05,11.22 34.05,11.1 | v34.06,11.1 34.01,11.2 34.05,11.22
IN5N  (via drill 0.35)
  Top 0.152: 31.92,15.95 31.92,16.07 31.88,16.07 ADS1299.7 31.88,15.92 31.88,11.81 31.27,11.2 v31.14,11.1 31.12,11.04 30.66,10.59 30.66,9.37 RN3.8 30.68,9.3
  Bottom 0.152: CN3.4 31.45,12.14 31.42,12.11 | 31.42,12.11 31.27,11.96 31.27,11.2 v31.14,11.1 | 31.42,12.11 CN3.4
IN5P  (via drill 0.35)
  Top 0.152: RN3.7 32.18,9.22 32.21,9.24 v32.21,11.07 32.36,11.22 32.35,15.92 | 32.35,15.92 32.35,15.96 32.45,16.06 | 32.35,15.92 32.33,15.92 ADS1299.8
  Bottom 0.152: v32.21,11.07 32.22,12.11 | 32.22,12.11 32.22,12.13 CN3.3 | CN3.3 32.18,12.11 32.22,12.11
IN6N  (via drill 0.35)
  Top 0.152: RN4.6 28.22,9.22 27.94,9.5 v27.94,11.07 30.84,13.97 30.84,15.95 ADS1299.5 30.96,16.07 ADS1299.5
  Bottom 0.152: v27.94,11.07 27.94,12.11 | 27.94,12.11 27.94,12.14 CN4.2 | CN4.2 27.91,12.11 27.94,12.11
IN6P  (via drill 0.35)
  Top 0.152: RN4.5 29.44,9.22 28.85,9.8 v28.85,11.07 31.45,13.66 31.45,15.92 | 31.45,15.92 31.45,15.95 ADS1299.6 | 31.45,15.92 31.42,15.92 ADS1299.6
  Bottom 0.152: v28.85,11.07 28.7,11.22 28.7,12.16 28.81,12.16 28.83,12.11 CN4.1
IN7N  (via drill 0.35)
  Top 0.152: RN4.8 25.78,9.22 26.11,9.55 v26.11,11.07 29.92,14.88 29.93,15.92 | 29.93,15.92 29.93,15.95 ADS1299.3 | 29.93,15.92 29.9,15.92 ADS1299.3
  Bottom 0.152: 26.41,12.11 26.42,11.37 v26.11,11.07 | 26.41,12.11 26.41,12.14 CN4.4 | CN4.4 26.39,12.11 26.41,12.11
IN7P  (via drill 0.35)
  Top 0.152: RN4.7 27,9.22 27.03,9.24 v27.03,11.07 30.38,14.42 30.36,15.92 | 30.36,15.92 30.36,15.96 30.45,16.05 | 30.36,15.92 30.35,15.92 ADS1299.4
  Bottom 0.152: 27.18,12.11 27.18,11.22 v27.03,11.07 | 27.18,12.11 27.18,12.14 CN4.3 | CN4.3 27.15,12.11 27.18,12.11
IN8N  (via drill 0.35)
  Top 0.152: RN5.6 22.91,9.73 v22.91,11.07 27.79,15.95 28.83,15.95 | 28.83,15.95 28.85,15.95 28.95,16.06 | 28.83,15.95 28.83,15.92 ADS1299.1
  Bottom 0.152: v22.91,11.07 22.91,12.11 | 22.91,12.11 22.91,12.14 CN5.2 | CN5.2 22.89,12.11 22.91,12.11
IN8P  (via drill 0.35)
  Top 0.152: RN5.5 24.26,9.37 23.83,9.8 v23.83,11.07 25.2,11.07 29.31,15.18 29.31,15.94 ADS1299.2
  Bottom 0.152: 23.68,12.11 23.67,11.35 23.83,11.2 v23.83,11.07 | 23.68,12.11 23.68,12.13 CN5.1 | CN5.1 23.65,12.11 23.68,12.11
N$1
  Top 0.254: ADS1299.62 ADS1299.63 25.88,18.67 23.68,16.47 C12.1 R2.2
N$2
  Top 0.203: ADS1299.28 39.52,23.67 42.8,26.95 C5.1
N$3
  Top 0.203: ADS1299.24 41.53,21.67 42.19,21 42.84,21 C10.1
  Top 0.254: C10.1 C11.1
N$4
  Top 0.152: C15.2 43.58,31.8 R1.1
N$6
  Top 0.203: ADS1299.30 39.38,24.67 43.22,28.51 C6.1
N$7
  Top 0.254: ADS1299.55 18.87,22.67 C8.1 C7.1
N$8
  Top 0.203: ADS1299.26 39.66,22.67 42.21,25.22 C9.1
PIN31
  Top 0.152: RASPBERRYHEADER.31 46.66,31.92 C15.1
PIN33
  Top 0.152: RASPBERRYHEADER.33 47.63,33.04 47.63,27.61 49.1,26.13 49.1,24.76 SW1.P$2
PIN35
  Top 0.152: RASPBERRYHEADER.35 51.84,34.51 51.84,28.72 53.98,26.59 JP2.5
PIN36
  Bottom 0.152: RASPBERRYHEADER.36 51.84,37.11 51.84,36.04 52.91,34.97 52.91,25.07 53.98,24 JP2.7
PIN37
  Top 0.152: RASPBERRYHEADER.37 54.28,33.19 55.42,32.05 55.42,30.32 54.13,29.03 JP2.3
PIN38
  Top 0.152: RASPBERRYHEADER.38 54.28,36.04 53.21,34.97 53.21,32.38 53.98,31.62 JP2.1
PWRDN  (via drill 0.35)
  Top 0.152: v34.44,32.74 35.41,31.64 35.41,27.83 ADS1299.35
  Bottom 0.152: v34.44,32.74 32.77,34.41 32.77,35.5 32.46,35.81 30.33,35.81 29.01,37.13 RASPBERRYHEADER.18
RESET  (via drill 0.35)  (1 unrouted)
  Top 0.152: ADS1299.36 34.95,27.83 34.95,30.58 v33.5,32.03
  Bottom 0.152: 33.5,31.97 32.64,31.97 29.92,34.69 29.92,35.38 29.24,36.06 27.48,36.06 26.42,37.13 RASPBERRYHEADER.16
SB1
  Top 0.152: RN1.3 43.61,7.08 43.61,4.95 44.07,4.49 JP1.1
SB2
  Top 0.152: RN1.4 44.83,7.08 44.83,5.1 45.14,4.8 45.14,2.82 44.22,1.9 JP1.2
SCLK  (via drill 0.35)
  Top 0.152: ADS1299.40 32.92,27.79 32.92,28.37 32.94,28.39 v32.94,29.23
  Bottom 0.152: v32.94,29.23 36.6,32.89 36.6,34.51 RASPBERRYHEADER.23
SRB1  (via drill 0.35)
  Top 0.152: RN1.6 43.48,11.07 v43.46,11.1 38.61,15.95 38.61,18.06 | 38.61,18.06 38.61,18.08 ADS1299.17 | 38.61,18.06 38.58,18.06 ADS1299.17
  Bottom 0.152: 43.32,12.11 43.32,12.13 43.26,12.19 | 43.32,12.11 43.33,11.22 v43.46,11.1 | CN1.2 43.31,12.11 43.32,12.11
SRB2  (via drill 0.35)
  Top 0.152: 44.55,9.24 44.68,9.22 | 38.58,18.65 39.42,18.64 41.81,16.25 41.81,13.97 41.78,13.94 44.53,11.2 v44.6,11.1 44.68,11.04 44.68,9.22 | 38.58,18.65 38.52,18.65 | ADS1299.18 38.58,18.66 38.58,18.65 | 44.68,9.22 RN1.5
  Bottom 0.152: v44.6,11.1 44.53,11.2 44.53,11.65 44.07,12.11 CN1.1
START  (via drill 0.35)
  Top 0.152: 33.88,27.83 ADS1299.38 33.93,29.76 32.69,31.01 v32.49,31.01
  Bottom 0.152: RASPBERRYHEADER.15 27.38,33.57 29.92,33.57 v32.49,31.01
TOOLGND  (via drill 0.35)
  Top 0.152: 41.63,31.35 R1.2 | 49.25,30.86 SW1.P$1 | 44.22,37.11 RASPBERRYHEADER.30
  Top 0.203: SW1.P$1 49.94,31.49 v49.94,32.43 | R1.2 41.67,32.32 v41.3,32.69
  pour Bottom (isolate 0.305): 42.95,37.64 42.95,33.57 42.57,33.19 40.79,33.19 40.79,30.53 51.97,30.53 51.97,33.32 45.36,33.32 45.24,33.45 45.24,37.64

### Text on the board
tNames: Epicap Pi Hat / Med students: Jennifer Cortes & Kenny Leung / Engineering students: Shiru Song, Casey Bryniaski, & Qihang Zhao / Business student: Jay Liu / Clinical Mentor: Fadi Mikhail, MD / Engineering Mentor: Jonathon Schuh, PhD